# Altium project Kogan LED to ESP32-C3-12F.PrjPCB
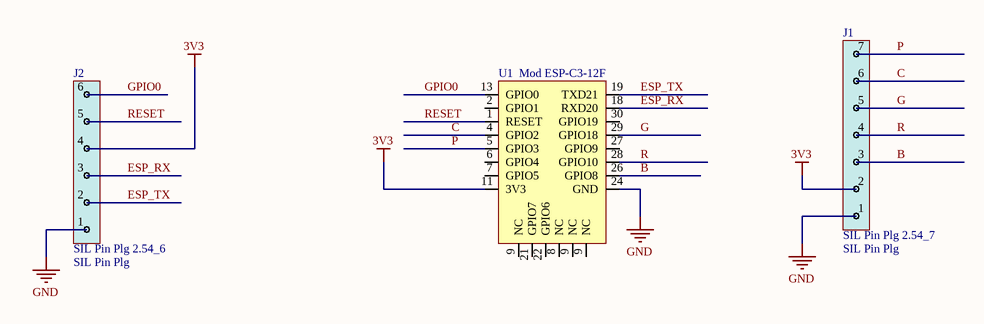
[diagram p0: ESP32 Schematic.SchDoc]
1 sheet, 3 parts. Net scope: global (net labels, ports and power ports of the same name join across sheets).
Board file: ESP32 PCB.PcbDoc

## Sheet ESP32 Schematic.SchDoc
size A3

### Parts
J1  SIL Pin Plg 2.54_7  Type: SIL Pin Plg  [SIL PIN PLG 2.54_7]
J2  SIL Pin Plg 2.54_6  Type: SIL Pin Plg  [SIL PIN PLG 2.54_6]
U1  Mod ESP-C3-12F  [ESP-C3-12F]

### Nets
3V3: J1.2 J2.4 U1.11(3V3)
GND: J1.1 J2.1 U1.24(GND)
B: J1.3 U1.26(GPIO8)
C: J1.6 U1.4(GPIO2)
ESP_RX: J2.3 U1.18(RXD20)
ESP_TX: J2.2 U1.19(TXD21)
G: J1.5 U1.29(GPIO18)
GPIO0: J2.6 U1.13(GPIO0)
P: J1.7 U1.5(GPIO3)
R: J1.4 U1.28(GPIO10)
RESET: J2.5 U1.1(RESET)

Not connected (* = marked no-connect by the designer): U1 2(GPIO1) 6(GPIO4) 7(GPIO5) 8(NC) 9(NC) 21(GPIO7) 22(GPIO6) 27(GPIO9) 30(GPIO19)

### Library data of the parts
J1 = SIL Pin Plg 2.54_7: 7 Way SIL Pins; Current: 2A; Voltage: 250V; Pitch: 2.54mm; Part Number: *
J2 = SIL Pin Plg 2.54_6: 6 Way SIL Pins; Current: 2A; Voltage: 250V; Pitch: 2.54mm; Part Number: *